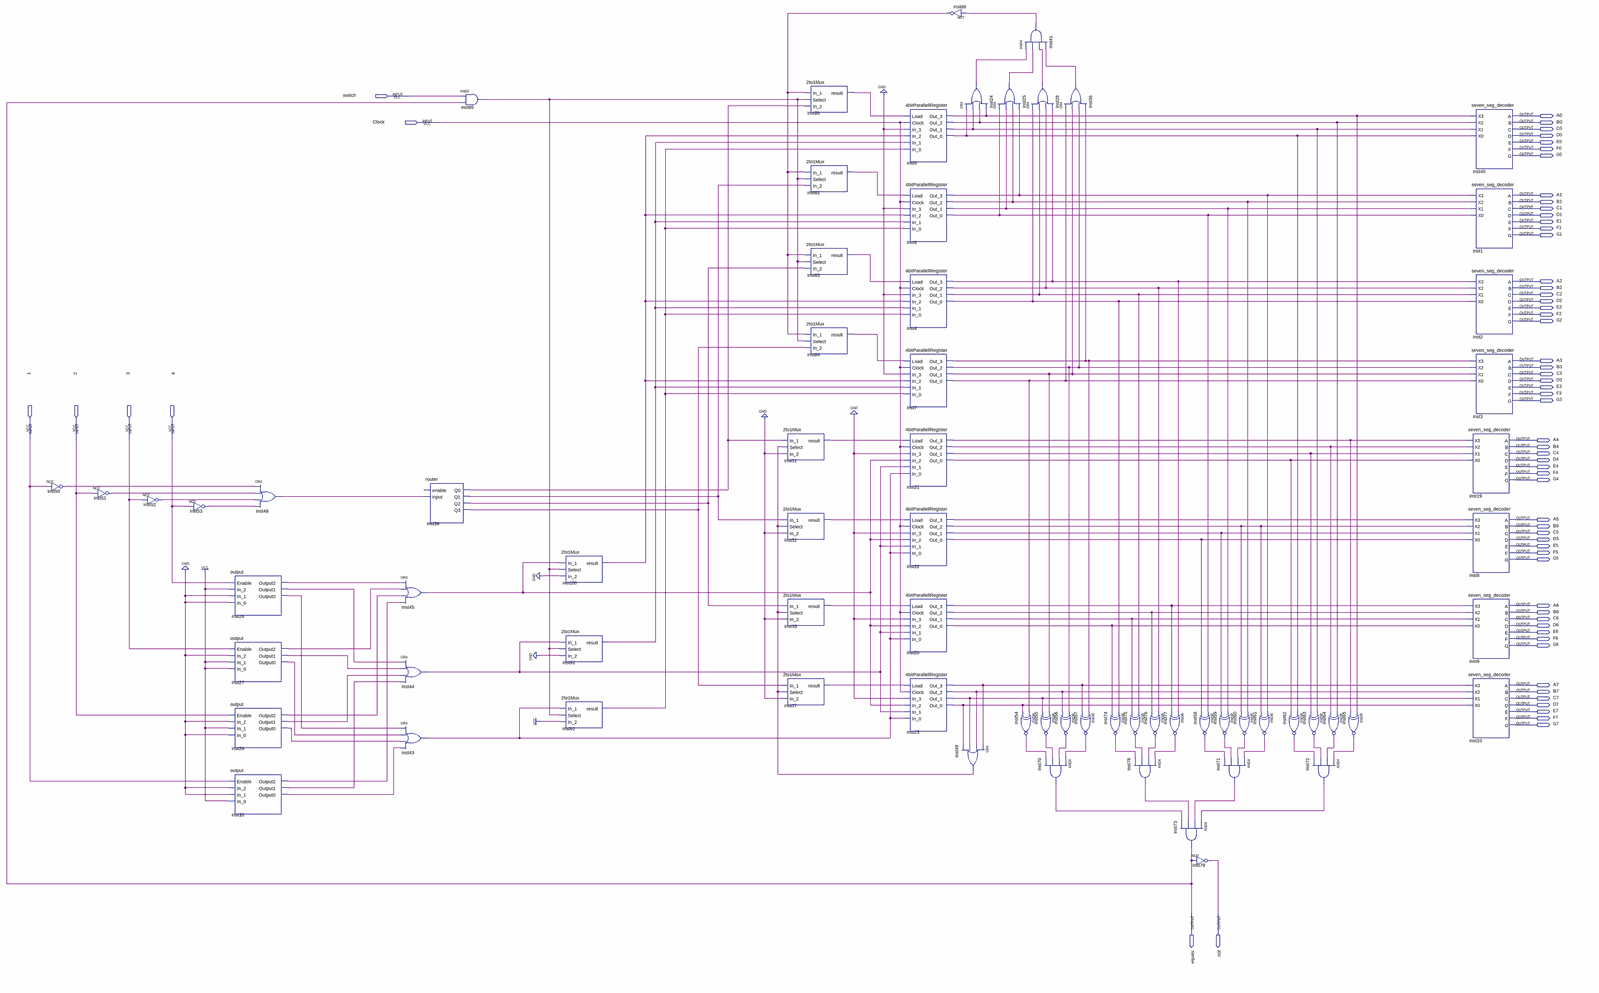
[diagram p0: schematic sheet, whole]
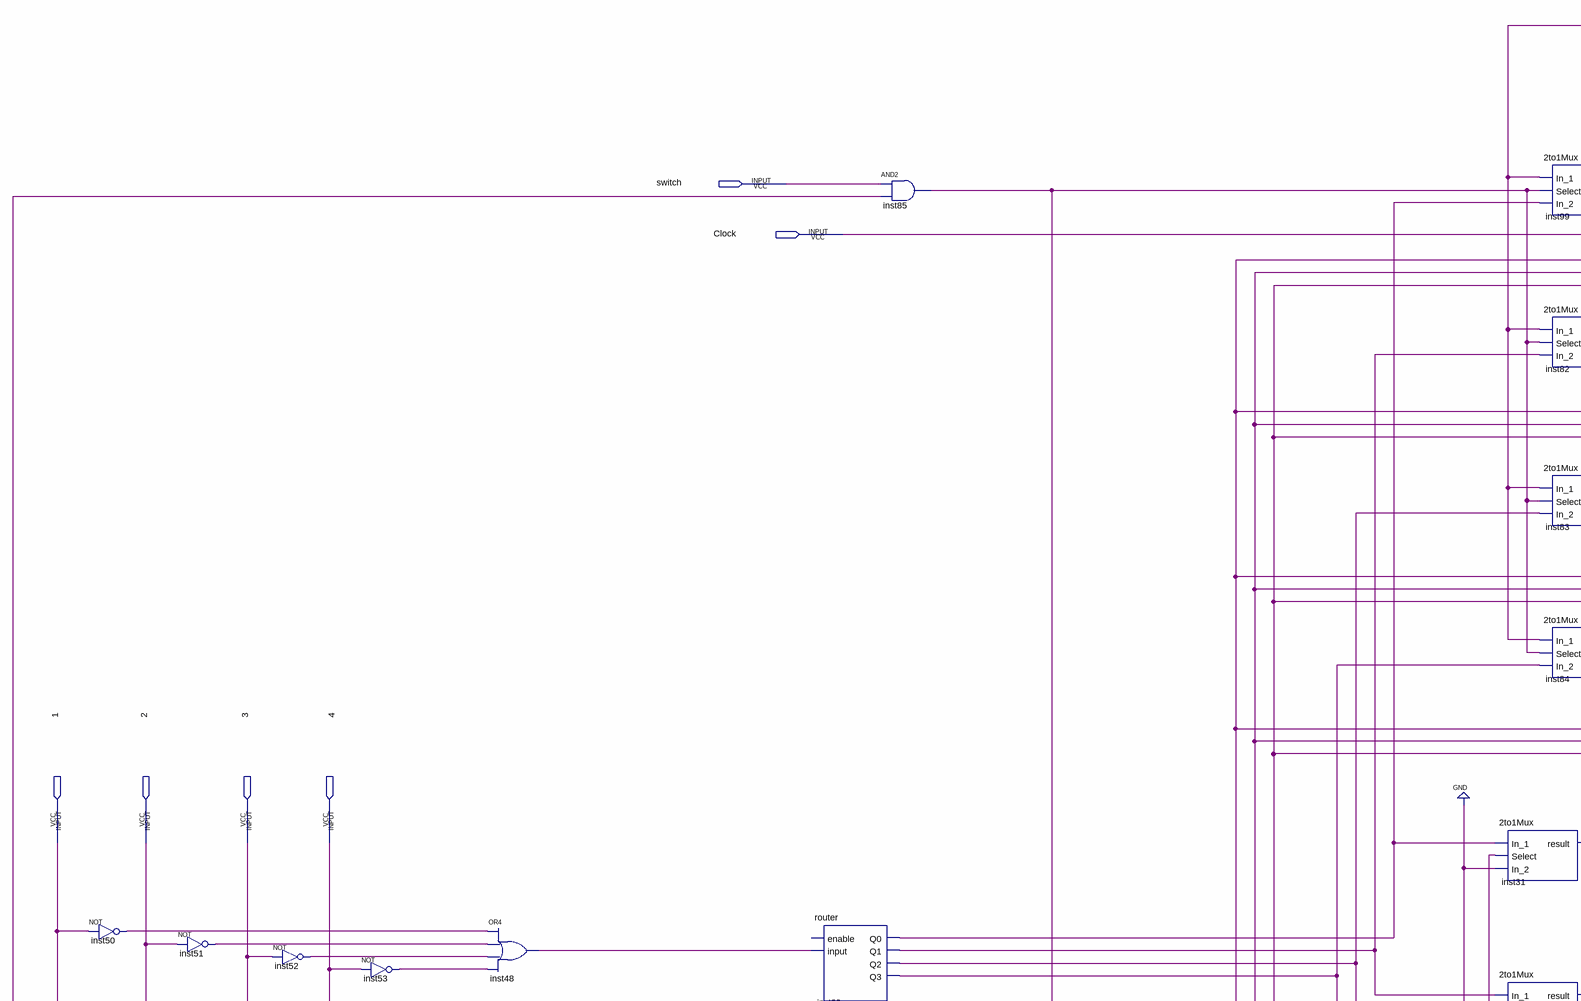
[diagram p1: schematic sheet, upper left part]
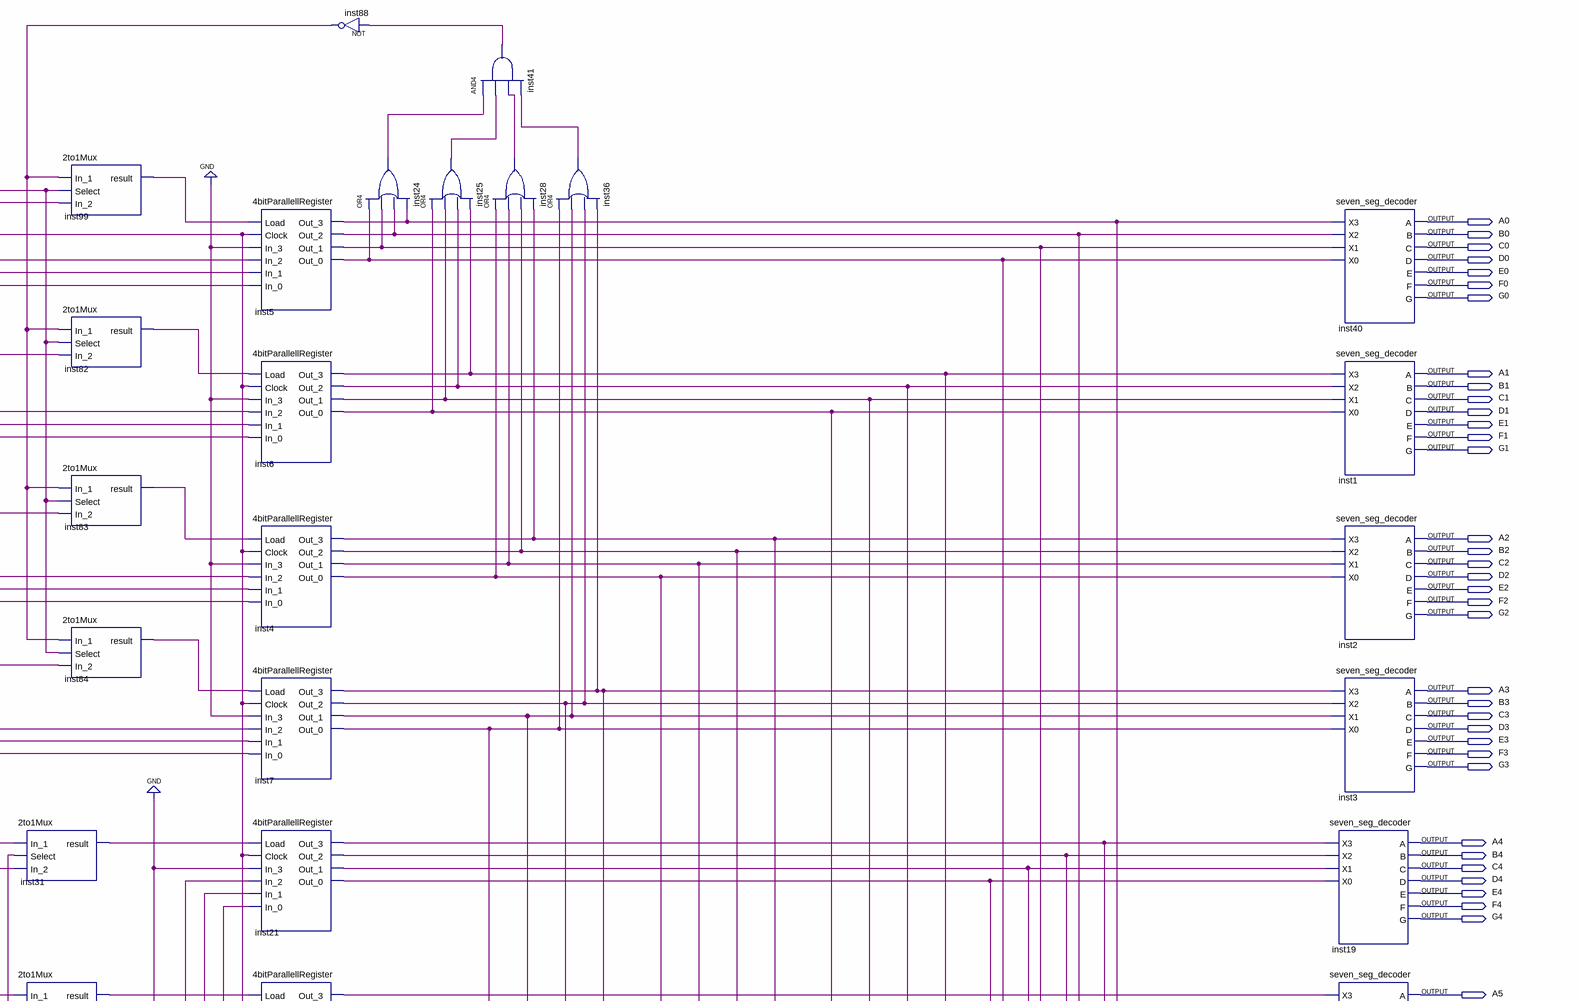
[diagram p2: schematic sheet, upper right part]
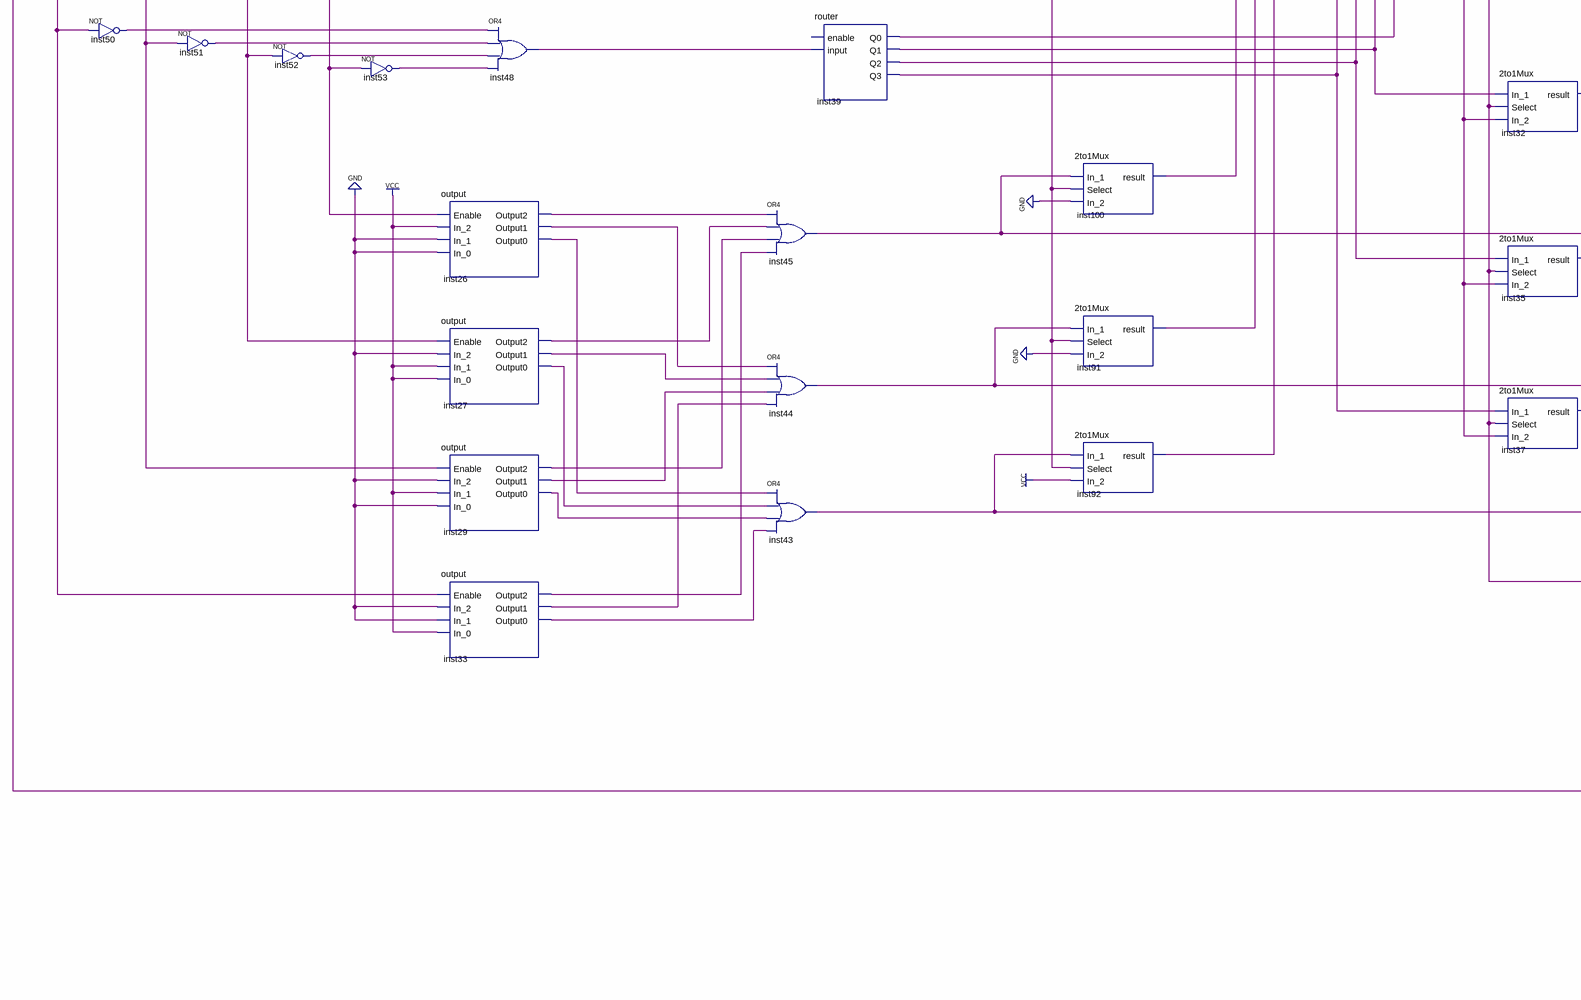
[diagram p3: schematic sheet, lower left part]
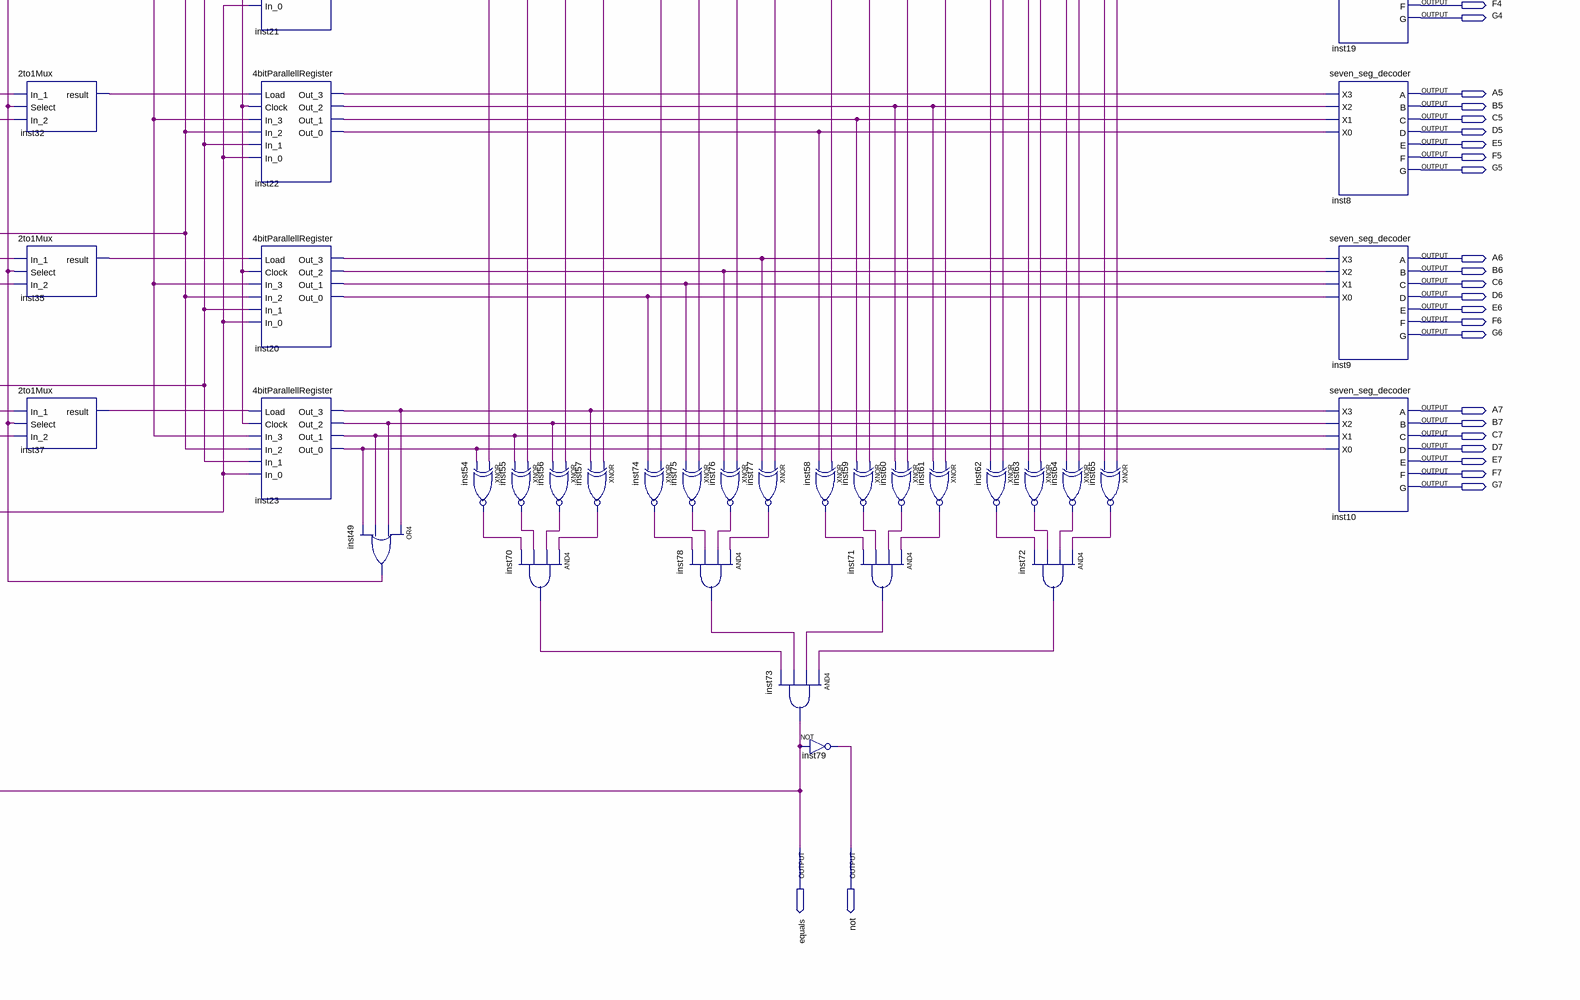
[diagram p4: schematic sheet, lower right part]
// Quartus schematic finalProject.bdf as structural Verilog: 70 symbols, 64 pins
module finalProject (
  input  switch,
  input  Clock,
  input  \1 ,
  input  \2 ,
  input  \3 ,
  input  \4 ,
  output A0,
  output B0,
  output C0,
  output D0,
  output E0,
  output F0,
  output G0,
  output A1,
  output B1,
  output C1,
  output D1,
  output E1,
  output F1,
  output G1,
  output A2,
  output B2,
  output C2,
  output D2,
  output E2,
  output F2,
  output G2,
  output A3,
  output B3,
  output C3,
  output D3,
  output E3,
  output F3,
  output G3,
  output A4,
  output B4,
  output C4,
  output D4,
  output E4,
  output F4,
  output G4,
  output A5,
  output B5,
  output C5,
  output D5,
  output E5,
  output F5,
  output G5,
  output A6,
  output B6,
  output C6,
  output D6,
  output E6,
  output F6,
  output G6,
  output A7,
  output B7,
  output C7,
  output D7,
  output E7,
  output F7,
  output G7,
  output equals,
  output \not 
);

  wire inst4_out_0, inst4_out_1, inst4_out_2, inst4_out_3, inst5_out_0, inst5_out_1, inst5_out_2,
       inst5_out_3, inst6_out_0, inst6_out_1, inst6_out_2, inst6_out_3, inst7_out_0, inst7_out_1,
       inst7_out_2, inst7_out_3, inst20_out_0, inst20_out_1, inst20_out_2, inst20_out_3, inst21_out_0,
       inst21_out_1, inst21_out_2, inst21_out_3, inst22_out_0, inst22_out_1, inst22_out_2, inst22_out_3,
       inst23_out_0, inst23_out_1, inst23_out_2, inst23_out_3, inst24_out, inst25_out, inst26_output0,
       inst26_output1, inst26_output2, inst27_output0, inst27_output1, inst27_output2, inst28_out,
       inst29_output0, inst29_output1, inst29_output2, inst31_result, inst32_result, inst33_output0,
       inst33_output1, inst33_output2, inst35_result, inst36_out, inst37_result, inst39_q0, inst39_q1,
       inst39_q2, inst39_q3, inst41_out, inst43_out, inst44_out, inst45_out, inst48_out, inst49_out,
       inst50_out, inst51_out, inst52_out, inst53_out, inst54_out, inst55_out, inst56_out, inst57_out,
       inst58_out, inst59_out, inst60_out, inst61_out, inst62_out, inst63_out, inst64_out, inst65_out,
       inst70_out, inst71_out, inst72_out, inst74_out, inst75_out, inst76_out, inst77_out, inst78_out,
       inst82_result, inst83_result, inst84_result, inst85_out, inst88_out, inst91_result, inst92_result,
       inst99_result, inst100_result;

  not inst50 (inst50_out, \1 );
  not inst51 (inst51_out, \2 );
  not inst52 (inst52_out, \3 );
  not inst53 (inst53_out, \4 );
  \output  inst26 (
    .Enable(\4 ), .In_2(1'b1), .In_1(1'b0), .In_0(1'b0), .Output2(inst26_output2), .Output1(inst26_output1),
    .Output0(inst26_output0));
  \output  inst27 (
    .Enable(\3 ), .In_2(1'b0), .In_1(1'b1), .In_0(1'b1), .Output2(inst27_output2), .Output1(inst27_output1),
    .Output0(inst27_output0));
  \output  inst29 (
    .Enable(\2 ), .In_2(1'b0), .In_1(1'b1), .In_0(1'b0), .Output2(inst29_output2), .Output1(inst29_output1),
    .Output0(inst29_output0));
  \output  inst33 (
    .Enable(\1 ), .In_2(1'b0), .In_1(1'b0), .In_0(1'b1), .Output2(inst33_output2), .Output1(inst33_output1),
    .Output0(inst33_output0));
  or inst48 (inst48_out, inst50_out, inst51_out, inst52_out, inst53_out);
  or inst45 (inst45_out, inst26_output2, inst27_output2, inst29_output2, inst33_output2);
  or inst44 (inst44_out, inst26_output1, inst27_output1, inst29_output1, inst33_output1);
  or inst43 (inst43_out, inst26_output0, inst27_output0, inst29_output0, inst33_output0);
  router inst39 (.\input (inst48_out), .Q0(inst39_q0), .Q1(inst39_q1), .Q2(inst39_q2), .Q3(inst39_q3));  // open: enable
  and inst85 (inst85_out, switch, equals);
  \2to1Mux  inst100 (.In_1(inst45_out), .Select(inst85_out), .In_2(1'b0), .result(inst100_result));
  \2to1Mux  inst91 (.In_1(inst44_out), .Select(inst85_out), .In_2(1'b0), .result(inst91_result));
  \2to1Mux  inst92 (.In_1(inst43_out), .Select(inst85_out), .In_2(1'b1), .result(inst92_result));
  \2to1Mux  inst31 (.In_1(inst39_q0), .Select(inst49_out), .In_2(1'b0), .result(inst31_result));
  \2to1Mux  inst32 (.In_1(inst39_q1), .Select(inst49_out), .In_2(1'b0), .result(inst32_result));
  \2to1Mux  inst35 (.In_1(inst39_q2), .Select(inst49_out), .In_2(1'b0), .result(inst35_result));
  \2to1Mux  inst37 (.In_1(inst39_q3), .Select(inst49_out), .In_2(1'b0), .result(inst37_result));
  \2to1Mux  inst99 (.In_1(inst88_out), .Select(inst85_out), .In_2(inst39_q0), .result(inst99_result));
  \2to1Mux  inst82 (.In_1(inst88_out), .Select(inst85_out), .In_2(inst39_q1), .result(inst82_result));
  \2to1Mux  inst83 (.In_1(inst88_out), .Select(inst85_out), .In_2(inst39_q2), .result(inst83_result));
  \2to1Mux  inst84 (.In_1(inst88_out), .Select(inst85_out), .In_2(inst39_q3), .result(inst84_result));
  \4bitParallellRegister  inst5 (
    .Load(inst99_result), .Clock(Clock), .In_3(1'b0), .In_2(inst100_result), .In_1(inst91_result),
    .In_0(inst92_result), .Out_2(inst5_out_2), .Out_1(inst5_out_1), .Out_0(inst5_out_0), .Out_3(inst5_out_3));
  \4bitParallellRegister  inst6 (
    .Load(inst82_result), .Clock(Clock), .In_3(1'b0), .In_2(inst100_result), .In_1(inst91_result),
    .In_0(inst92_result), .Out_2(inst6_out_2), .Out_1(inst6_out_1), .Out_0(inst6_out_0), .Out_3(inst6_out_3));
  \4bitParallellRegister  inst4 (
    .Load(inst83_result), .Clock(Clock), .In_3(1'b0), .In_2(inst100_result), .In_1(inst91_result),
    .In_0(inst92_result), .Out_2(inst4_out_2), .Out_1(inst4_out_1), .Out_0(inst4_out_0), .Out_3(inst4_out_3));
  \4bitParallellRegister  inst7 (
    .Load(inst84_result), .Clock(Clock), .In_3(1'b0), .In_2(inst100_result), .In_1(inst91_result),
    .In_0(inst92_result), .Out_2(inst7_out_2), .Out_1(inst7_out_1), .Out_0(inst7_out_0), .Out_3(inst7_out_3));
  \4bitParallellRegister  inst21 (
    .Load(inst31_result), .Clock(Clock), .In_3(1'b0), .In_2(inst45_out), .In_1(inst44_out),
    .In_0(inst43_out), .Out_2(inst21_out_2), .Out_1(inst21_out_1), .Out_0(inst21_out_0), .Out_3(inst21_out_3));
  \4bitParallellRegister  inst22 (
    .Load(inst32_result), .Clock(Clock), .In_3(1'b0), .In_2(inst45_out), .In_1(inst44_out),
    .In_0(inst43_out), .Out_2(inst22_out_2), .Out_1(inst22_out_1), .Out_0(inst22_out_0), .Out_3(inst22_out_3));
  \4bitParallellRegister  inst20 (
    .Load(inst35_result), .Clock(Clock), .In_3(1'b0), .In_2(inst45_out), .In_1(inst44_out),
    .In_0(inst43_out), .Out_2(inst20_out_2), .Out_1(inst20_out_1), .Out_0(inst20_out_0), .Out_3(inst20_out_3));
  \4bitParallellRegister  inst23 (
    .Load(inst37_result), .Clock(Clock), .In_3(1'b0), .In_2(inst45_out), .In_1(inst44_out),
    .In_0(inst43_out), .Out_2(inst23_out_2), .Out_1(inst23_out_1), .Out_0(inst23_out_0), .Out_3(inst23_out_3));
  not inst88 (inst88_out, inst41_out);
  or inst24 (inst24_out, inst5_out_0, inst5_out_1, inst5_out_2, inst5_out_3);
  or inst49 (inst49_out, inst23_out_3, inst23_out_2, inst23_out_1, inst23_out_0);
  or inst25 (inst25_out, inst6_out_0, inst6_out_1, inst6_out_2, inst6_out_3);
  and inst41 (inst41_out, inst24_out, inst25_out, inst28_out, inst36_out);
  or inst28 (inst28_out, inst4_out_0, inst4_out_1, inst4_out_2, inst4_out_3);
  xnor inst54 (inst54_out, inst7_out_0, inst23_out_0);
  xnor inst55 (inst55_out, inst7_out_1, inst23_out_1);
  and inst70 (inst70_out, inst57_out, inst56_out, inst55_out, inst54_out);
  or inst36 (inst36_out, inst7_out_0, inst7_out_1, inst7_out_2, inst7_out_3);
  xnor inst56 (inst56_out, inst7_out_2, inst23_out_2);
  xnor inst57 (inst57_out, inst7_out_3, inst23_out_3);
  xnor inst74 (inst74_out, inst4_out_0, inst20_out_0);
  xnor inst75 (inst75_out, inst4_out_1, inst20_out_1);
  xnor inst76 (inst76_out, inst4_out_2, inst20_out_2);
  and inst78 (inst78_out, inst77_out, inst76_out, inst75_out, inst74_out);
  xnor inst77 (inst77_out, inst4_out_3, inst20_out_3);
  xnor inst58 (inst58_out, inst6_out_0, inst22_out_0);
  and inst73 (equals, inst72_out, inst71_out, inst78_out, inst70_out);
  not inst79 (\not , equals);
  xnor inst59 (inst59_out, inst6_out_1, inst22_out_1);
  and inst71 (inst71_out, inst61_out, inst60_out, inst59_out, inst58_out);
  xnor inst60 (inst60_out, inst6_out_2, inst22_out_2);
  xnor inst61 (inst61_out, inst6_out_3, inst22_out_2);
  xnor inst62 (inst62_out, inst5_out_0, inst21_out_0);
  xnor inst63 (inst63_out, inst5_out_1, inst21_out_1);
  xnor inst64 (inst64_out, inst5_out_2, inst21_out_2);
  and inst72 (inst72_out, inst65_out, inst64_out, inst63_out, inst62_out);
  xnor inst65 (inst65_out, inst5_out_3, inst21_out_3);
  seven_seg_decoder inst40 (
    .X3(inst5_out_3), .X2(inst5_out_2), .X1(inst5_out_1), .X0(inst5_out_0), .A(A0), .B(B0), .C(C0), .D(D0),
    .E(E0), .F(F0), .G(G0));
  seven_seg_decoder inst1 (
    .X3(inst6_out_3), .X2(inst6_out_2), .X1(inst6_out_1), .X0(inst6_out_0), .A(A1), .B(B1), .C(C1), .D(D1),
    .E(E1), .F(F1), .G(G1));
  seven_seg_decoder inst2 (
    .X3(inst4_out_3), .X2(inst4_out_2), .X1(inst4_out_1), .X0(inst4_out_0), .A(A2), .B(B2), .C(C2), .D(D2),
    .E(E2), .F(F2), .G(G2));
  seven_seg_decoder inst3 (
    .X3(inst7_out_3), .X2(inst7_out_2), .X1(inst7_out_1), .X0(inst7_out_0), .A(A3), .B(B3), .C(C3), .D(D3),
    .E(E3), .F(F3), .G(G3));
  seven_seg_decoder inst19 (
    .X3(inst21_out_3), .X2(inst21_out_2), .X1(inst21_out_1), .X0(inst21_out_0), .A(A4), .B(B4), .C(C4),
    .D(D4), .E(E4), .F(F4), .G(G4));
  seven_seg_decoder inst8 (
    .X3(inst22_out_3), .X2(inst22_out_2), .X1(inst22_out_1), .X0(inst22_out_0), .A(A5), .B(B5), .C(C5),
    .D(D5), .E(E5), .F(F5), .G(G5));
  seven_seg_decoder inst9 (
    .X3(inst20_out_3), .X2(inst20_out_2), .X1(inst20_out_1), .X0(inst20_out_0), .A(A6), .B(B6), .C(C6),
    .D(D6), .E(E6), .F(F6), .G(G6));
  seven_seg_decoder inst10 (
    .X3(inst23_out_3), .X2(inst23_out_2), .X1(inst23_out_1), .X0(inst23_out_0), .A(A7), .B(B7), .C(C7),
    .D(D7), .E(E7), .F(F7), .G(G7));
endmodule
